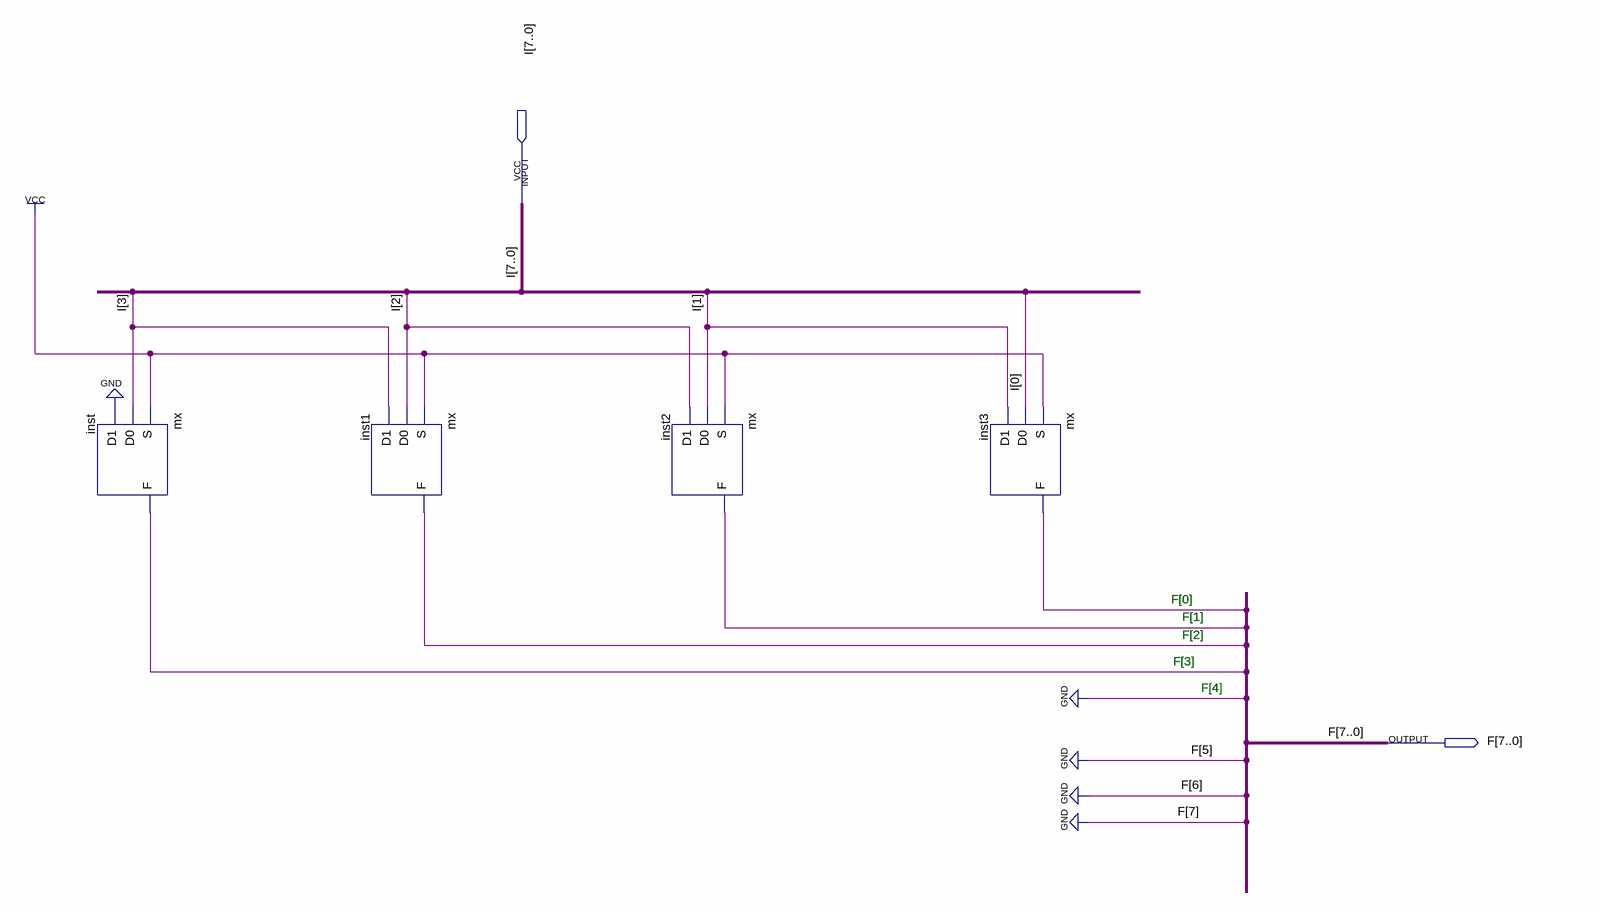
[diagram p0: schematic sheet]
// Quartus schematic ShiftR.bdf as structural Verilog: 4 symbols, 2 pins
module ShiftR (
  input  [7:0] I,
  output [7:0] F
);

  mx inst (.S(1'b1), .D0(I[3]), .D1(1'b0), .F(F[3]));
  mx inst1 (.S(1'b1), .D0(I[2]), .D1(I[3]), .F(F[2]));
  mx inst2 (.S(1'b1), .D0(I[1]), .D1(I[2]), .F(F[1]));
  mx inst3 (.S(1'b1), .D0(I[0]), .D1(I[1]), .F(F[0]));

  assign F[7:4] = 4'b0000;

  // Notes on the sheet:
  //   F[0]
  //   F[0]
  //   F[1]
  //   F[1]
  //   F[2]
  //   F[2]
  //   F[3]
  //   F[3]
  //   F[4]
endmodule
